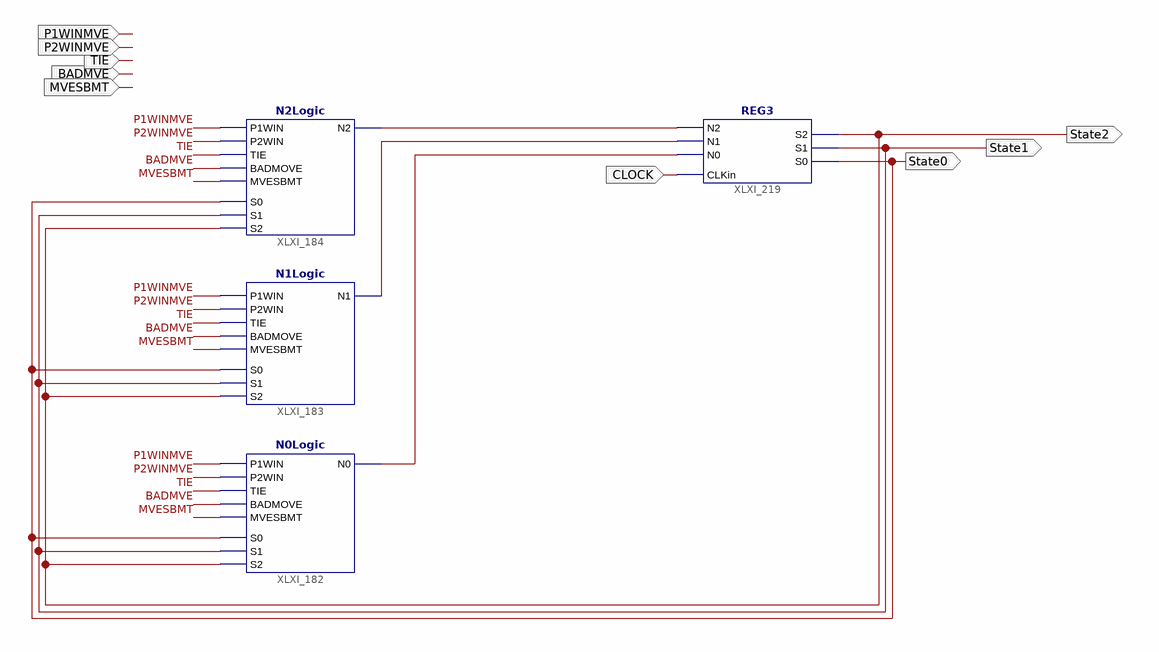
[diagram p0: schematic sheet 1]
// Xilinx ISE schematic StateLogic.sch (spartan6) as structural Verilog: 4 symbols, 9 ports
module StateLogic (
  input  P1WINMVE,
  input  TIE,
  input  BADMVE,
  input  MVESBMT,
  input  P2WINMVE,
  input  CLOCK,
  output State1,
  output State0,
  output State2
);

  wire XLXN_350, XLXN_359, XLXN_360;

  N0Logic XLXI_182 (
    .N0(XLXN_360), .P1WIN(P1WINMVE), .P2WIN(P2WINMVE), .TIE(TIE), .BADMOVE(BADMVE), .MVESBMT(MVESBMT),
    .S1(State1), .S0(State0), .S2(State2));
  N2Logic XLXI_184 (
    .N2(XLXN_350), .P2WIN(P2WINMVE), .P1WIN(P1WINMVE), .TIE(TIE), .BADMOVE(BADMVE), .MVESBMT(MVESBMT),
    .S0(State0), .S1(State1), .S2(State2));
  N1Logic XLXI_183 (
    .N1(XLXN_359), .P1WIN(P1WINMVE), .P2WIN(P2WINMVE), .TIE(TIE), .BADMOVE(BADMVE), .MVESBMT(MVESBMT),
    .S0(State0), .S1(State1), .S2(State2));
  REG3 XLXI_219 (.N2(XLXN_350), .N1(XLXN_359), .N0(XLXN_360), .CLKin(CLOCK), .S1(State1), .S0(State0), .S2(State2));
endmodule
